# Altium schematic sheet MSP432.SchDoc
size A3
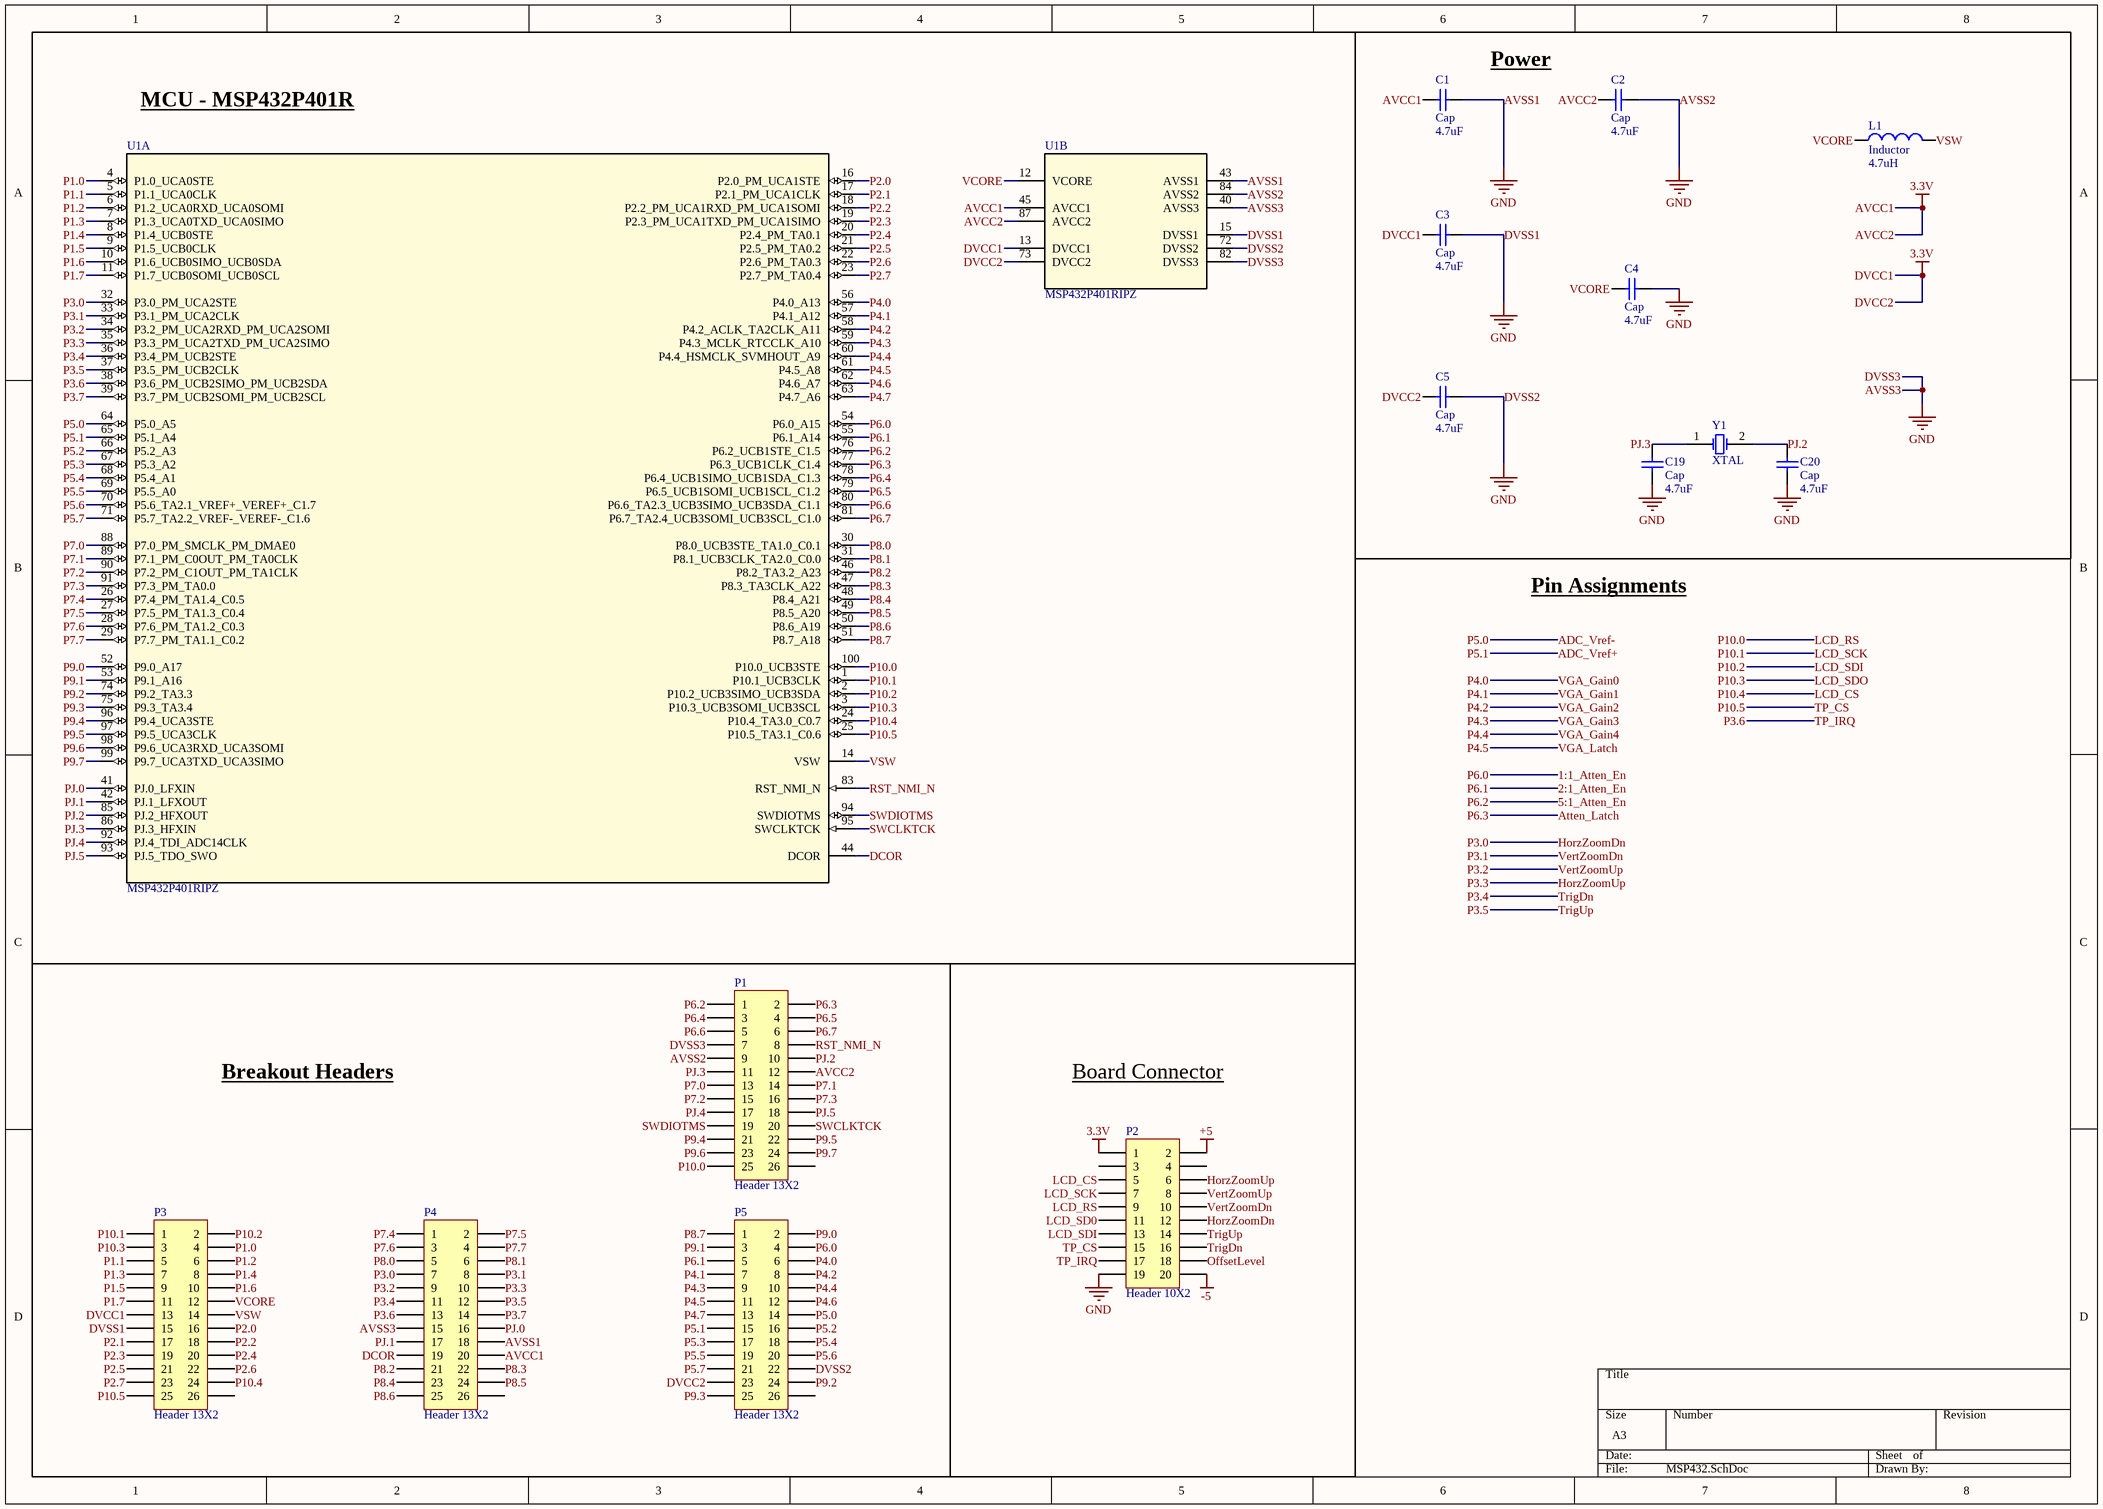
[diagram p0: MSP432.SchDoc]

## Parts
C1  Cap  value 4.7uF  [6-0805_N]
C2  Cap  value 4.7uF  [6-0805_N]
C3  Cap  value 4.7uF  [6-0805_N]
C4  Cap  value 4.7uF  [6-0805_N]
C5  Cap  value 4.7uF  [6-0805_N]
C19  Cap  value 4.7uF  [6-0805_N]
C20  Cap  value 4.7uF  [6-0805_N]
L1  Inductor  value 4.7uH  [6-0805_N]
P1  Header 13X2  [HDR2X13]
P2  Header 10X2  [HDR2X10]
P3  Header 13X2  [HDR2X13]
P4  Header 13X2  [HDR2X13]
P5  Header 13X2  [HDR2X13]
U1  MSP432P401RIPZ  [PZ0100A_N]  (parts A,B of 2)
Y1  XTAL  [HC-49U]

## Blocks framed on the sheet
MCU - MSP432P401R: U1
Power: C1-C5 C19 C20 L1 Y1
Breakout Headers: P1 P3-P5
Board Connector: P2

## Nets
+5: P2.2
-5: P2.20
AVCC1: C1.1 C2.1 C3.1 C5.1 P1.12 P2.1 P3.13 P4.20 P5.23 U1.13(DVCC1) U1.45(AVCC1) U1.73(DVCC2) U1.87(AVCC2)  [also labelled 3.3V, AVCC2, DVCC1, DVCC2]
AVSS1: C1.2 C2.2 C3.2 C4.2 C5.2 C19.1 C20.2 P1.7 P1.9 P2.19 P3.15 P4.15 P4.18 P5.22 U1.15(DVSS1) U1.40(AVSS3) U1.43(AVSS1) U1.72(DVSS2) U1.82(DVSS3) U1.84(AVSS2)  [also labelled AVSS2, AVSS3, DVSS1, DVSS2, DVSS3, GND]
1:1_Atten_En: P5.4 U1.54(P6.0_A15)  [also labelled P6.0]
2:1_Atten_En: P5.5 U1.55(P6.1_A14)  [also labelled P6.1]
5:1_Atten_En: P1.1 U1.76(P6.2_UCB1STE_C1.5)  [also labelled P6.2]
ADC_Vref+: P5.15 U1.65(P5.1_A4)  [also labelled P5.1]
ADC_Vref-: P5.14 U1.64(P5.0_A5)  [also labelled P5.0]
Atten_Latch: P1.2 U1.77(P6.3_UCB1CLK_C1.4)  [also labelled P6.3]
DCOR: P4.19 U1.44(DCOR)
HorzZoomDn: P2.12 P4.7 U1.32(P3.0_PM_UCA2STE)  [also labelled P3.0]
HorzZoomUp: P2.6 P4.10 U1.35(P3.3_PM_UCA2TXD_PM_UCA2SIMO)  [also labelled P3.3]
LCD_CS: P2.5 P3.24 U1.24(P10.4_TA3.0_C0.7)  [also labelled P10.4]
LCD_RS: P1.25 P2.9 U1.100(P10.0_UCB3STE)  [also labelled P10.0]
LCD_SCK: P2.7 P3.1 U1.1(P10.1_UCB3CLK)  [also labelled P10.1]
LCD_SD0: P2.11
LCD_SDI: P2.13 P3.2 U1.2(P10.2_UCB3SIMO_UCB3SDA)  [also labelled P10.2]
LCD_SDO: P3.3 U1.3(P10.3_UCB3SOMI_UCB3SCL)  [also labelled P10.3]
OffsetLevel: P2.18
P1.0: P3.4 U1.4(P1.0_UCA0STE)
P1.1: P3.5 U1.5(P1.1_UCA0CLK)
P1.2: P3.6 U1.6(P1.2_UCA0RXD_UCA0SOMI)
P1.3: P3.7 U1.7(P1.3_UCA0TXD_UCA0SIMO)
P1.4: P3.8 U1.8(P1.4_UCB0STE)
P1.5: P3.9 U1.9(P1.5_UCB0CLK)
P1.6: P3.10 U1.10(P1.6_UCB0SIMO_UCB0SDA)
P1.7: P3.11 U1.11(P1.7_UCB0SOMI_UCB0SCL)
P2.0: P3.16 U1.16(P2.0_PM_UCA1STE)
P2.1: P3.17 U1.17(P2.1_PM_UCA1CLK)
P2.2: P3.18 U1.18(P2.2_PM_UCA1RXD_PM_UCA1SOMI)
P2.3: P3.19 U1.19(P2.3_PM_UCA1TXD_PM_UCA1SIMO)
P2.4: P3.20 U1.20(P2.4_PM_TA0.1)
P2.5: P3.21 U1.21(P2.5_PM_TA0.2)
P2.6: P3.22 U1.22(P2.6_PM_TA0.3)
P2.7: P3.23 U1.23(P2.7_PM_TA0.4)
P3.1: P2.10 P4.8 U1.33(P3.1_PM_UCA2CLK)  [also labelled VertZoomDn]
P3.2: P2.8 P4.9 U1.34(P3.2_PM_UCA2RXD_PM_UCA2SOMI)  [also labelled VertZoomUp]
P3.4: P2.16 P4.11 U1.36(P3.4_PM_UCB2STE)  [also labelled TrigDn]
P3.5: P2.14 P4.12 U1.37(P3.5_PM_UCB2CLK)  [also labelled TrigUp]
P3.6: P2.17 P4.13 U1.38(P3.6_PM_UCB2SIMO_PM_UCB2SDA)  [also labelled TP_IRQ]
P3.7: P4.14 U1.39(P3.7_PM_UCB2SOMI_PM_UCB2SCL)
P4.0: P5.6 U1.56(P4.0_A13)  [also labelled VGA_Gain0]
P4.1: P5.7 U1.57(P4.1_A12)  [also labelled VGA_Gain1]
P4.2: P5.8 U1.58(P4.2_ACLK_TA2CLK_A11)  [also labelled VGA_Gain2]
P4.3: P5.9 U1.59(P4.3_MCLK_RTCCLK_A10)  [also labelled VGA_Gain3]
P4.4: P5.10 U1.60(P4.4_HSMCLK_SVMHOUT_A9)  [also labelled VGA_Gain4]
P4.5: P5.11 U1.61(P4.5_A8)  [also labelled VGA_Latch]
P4.6: P5.12 U1.62(P4.6_A7)
P4.7: P5.13 U1.63(P4.7_A6)
P5.2: P5.16 U1.66(P5.2_A3)
P5.3: P5.17 U1.67(P5.3_A2)
P5.4: P5.18 U1.68(P5.4_A1)
P5.5: P5.19 U1.69(P5.5_A0)
P5.6: P5.20 U1.70(P5.6_TA2.1_VREF+_VEREF+_C1.7)
P5.7: P5.21 U1.71(P5.7_TA2.2_VREF-_VEREF-_C1.6)
P6.4: P1.3 U1.78(P6.4_UCB1SIMO_UCB1SDA_C1.3)
P6.5: P1.4 U1.79(P6.5_UCB1SOMI_UCB1SCL_C1.2)
P6.6: P1.5 U1.80(P6.6_TA2.3_UCB3SIMO_UCB3SDA_C1.1)
P6.7: P1.6 U1.81(P6.7_TA2.4_UCB3SOMI_UCB3SCL_C1.0)
P7.0: P1.13 U1.88(P7.0_PM_SMCLK_PM_DMAE0)
P7.1: P1.14 U1.89(P7.1_PM_C0OUT_PM_TA0CLK)
P7.2: P1.15 U1.90(P7.2_PM_C1OUT_PM_TA1CLK)
P7.3: P1.16 U1.91(P7.3_PM_TA0.0)
P7.4: P4.1 U1.26(P7.4_PM_TA1.4_C0.5)
P7.5: P4.2 U1.27(P7.5_PM_TA1.3_C0.4)
P7.6: P4.3 U1.28(P7.6_PM_TA1.2_C0.3)
P7.7: P4.4 U1.29(P7.7_PM_TA1.1_C0.2)
P8.0: P4.5 U1.30(P8.0_UCB3STE_TA1.0_C0.1)
P8.1: P4.6 U1.31(P8.1_UCB3CLK_TA2.0_C0.0)
P8.2: P4.21 U1.46(P8.2_TA3.2_A23)
P8.3: P4.22 U1.47(P8.3_TA3CLK_A22)
P8.4: P4.23 U1.48(P8.4_A21)
P8.5: P4.24 U1.49(P8.5_A20)
P8.6: P4.25 U1.50(P8.6_A19)
P8.7: P5.1 U1.51(P8.7_A18)
P9.0: P5.2 U1.52(P9.0_A17)
P9.1: P5.3 U1.53(P9.1_A16)
P9.2: P5.24 U1.74(P9.2_TA3.3)
P9.3: P5.25 U1.75(P9.3_TA3.4)
P9.4: P1.21 U1.96(P9.4_UCA3STE)
P9.5: P1.22 U1.97(P9.5_UCA3CLK)
P9.6: P1.23 U1.98(P9.6_UCA3RXD_UCA3SOMI)
P9.7: P1.24 U1.99(P9.7_UCA3TXD_UCA3SIMO)
P10.5: P2.15 P3.25 U1.25(P10.5_TA3.1_C0.6)  [also labelled TP_CS]
PJ.0: P4.16 U1.41(PJ.0_LFXIN)
PJ.1: P4.17 U1.42(PJ.1_LFXOUT)
PJ.2: C20.1 P1.10 U1.85(PJ.2_HFXOUT) Y1.2(OSC2)
PJ.3: C19.2 P1.11 U1.86(PJ.3_HFXIN) Y1.1(OSC1)
PJ.4: P1.17 U1.92(PJ.4_TDI_ADC14CLK)
PJ.5: P1.18 U1.93(PJ.5_TDO_SWO)
RST_NMI_N: P1.8 U1.83(RST_NMI_N)
SWCLKTCK: P1.20 U1.95(SWCLKTCK)
SWDIOTMS: P1.19 U1.94(SWDIOTMS)
VCORE: C4.1 L1.1 P3.12 U1.12(VCORE)
VSW: L1.2 P3.14 U1.14(VSW)

Not connected (* = marked no-connect by the designer): P1 26; P2 3 4; P3 26; P4 26; P5 26

## Notes on the sheet
- Pin Assignments

## Library data of the parts
C1-C5 C19 C20 = Cap: Capacitor; Published: 8-Jun-2000; LatestRevisionDate: 17-Jul-2002; LatestRevisionNote: Re-released for DXP Platform.; PackageReference: RAD-0.3; Publisher: Altium Limited; PackageDescription: Radial Cap, Thru-Hole; 2 Leads; 0.3 in Pin Spacing
L1 = Inductor: Code_IEC: 1005; Published: 8-Jun-2000; LatestRevisionDate: 29-May-2009; LatestRevisionNote: IPC-7351 Footprint Added.; PackageReference: 0402-A; Publisher: Altium Limited; PackageDescription: Chip Inductor; Code_JEITA: 0402
P1 P3-P5 = Header 13X2: Header, 13-Pin, Dual row; LatestRevisionDate: 17-Jul-2002; LatestRevisionNote: Re-released for DXP Platform.; Publisher: Altium Limited
P2 = Header 10X2: Header, 10-Pin, Dual row; LatestRevisionDate: 17-Jul-2002; LatestRevisionNote: Re-released for DXP Platform.; Publisher: Altium Limited
U1 = MSP432P401RIPZ: No Description Available; PartNumber: XMS432P401RIPZR; Manufacturer: Texas Instruments; CompType: IC; PIN_COUNT: 100; PackageReference: PZ0100A; MountType: SMT; RefDes: RefDes; Type: DEV; Value: Value; Copyright: Copyright (C) 2018 Accelerated Designs. All rights reserved
Y1 = XTAL: Crystal Oscillator; Published: 8-Jun-2000; LatestRevisionDate: 17-Jul-2002; LatestRevisionNote: Re-released for DXP Platform.; PackageReference: R38; Publisher: Altium Limited; PackageDescription: Crystal, Thru-Hole; 2 Leads; Body 3.1 x 8.2 mm (Dia.xH)